# Altium schematic sheet RF.SchDoc: CATS Telemetry
size A4; Author: Luca Jost; Revision: 1.0; SheetNumber: 4; SheetTotal: 7; Subtitle: RF
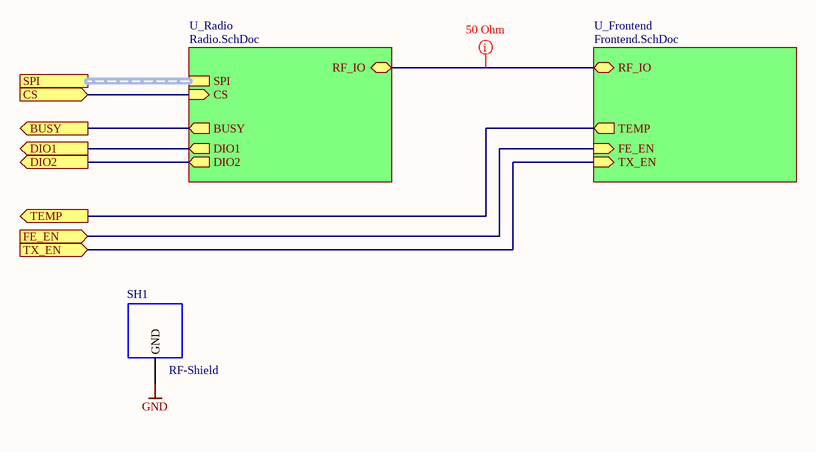
[diagram p0: RF.SchDoc]

## Parts
SH1  RF-Shield  [SMD Shield 36903205S]

## Sub-sheets
U_Frontend = Frontend.SchDoc: FE_EN (in), TX_EN (in), TEMP (out), RF_IO (bidir)
U_Radio = Radio.SchDoc: SPI (harness SPI), CS (in), BUSY (out), DIO1 (out), DIO2 (out), RF_IO (bidir)

## Ports
BUSY (out), CS (in), DIO1 (out), DIO2 (out), FE_EN (in), SPI (harness SPI), TEMP (out), TX_EN (in)

## Nets
GND: SH1.0(GND)
BUSY: port BUSY, sheet U_Radio/BUSY
CS: port CS, sheet U_Radio/CS
DIO1: port DIO1, sheet U_Radio/DIO1
DIO2: port DIO2, sheet U_Radio/DIO2
FE_EN: port FE_EN, sheet U_Frontend/FE_EN
TEMP: port TEMP, sheet U_Frontend/TEMP
TX_EN: port TX_EN, sheet U_Frontend/TX_EN
(unnamed): sheet U_Frontend/RF_IO, sheet U_Radio/RF_IO

## Buses and harness runs
harness port SPI = sheet U_Radio/SPI

## Layout directives
rule Impedance Constraint [Min = 50.00    Max = 50.00    ]: (no net found under the mark)

## Notes on the sheet
- Title
- Author:
- Subtitle
- Date:
- Rev:
- CATS
- Sheet
- of
- File:

## Library data of the parts
SH1 = RF-Shield 20x20mm: RF Shield Cover 0.787" (20.00mm) X 0.787" (20.00mm) Non-Vented Snap Fit